# Altium schematic sheet FPGA.SCHDOC
size B
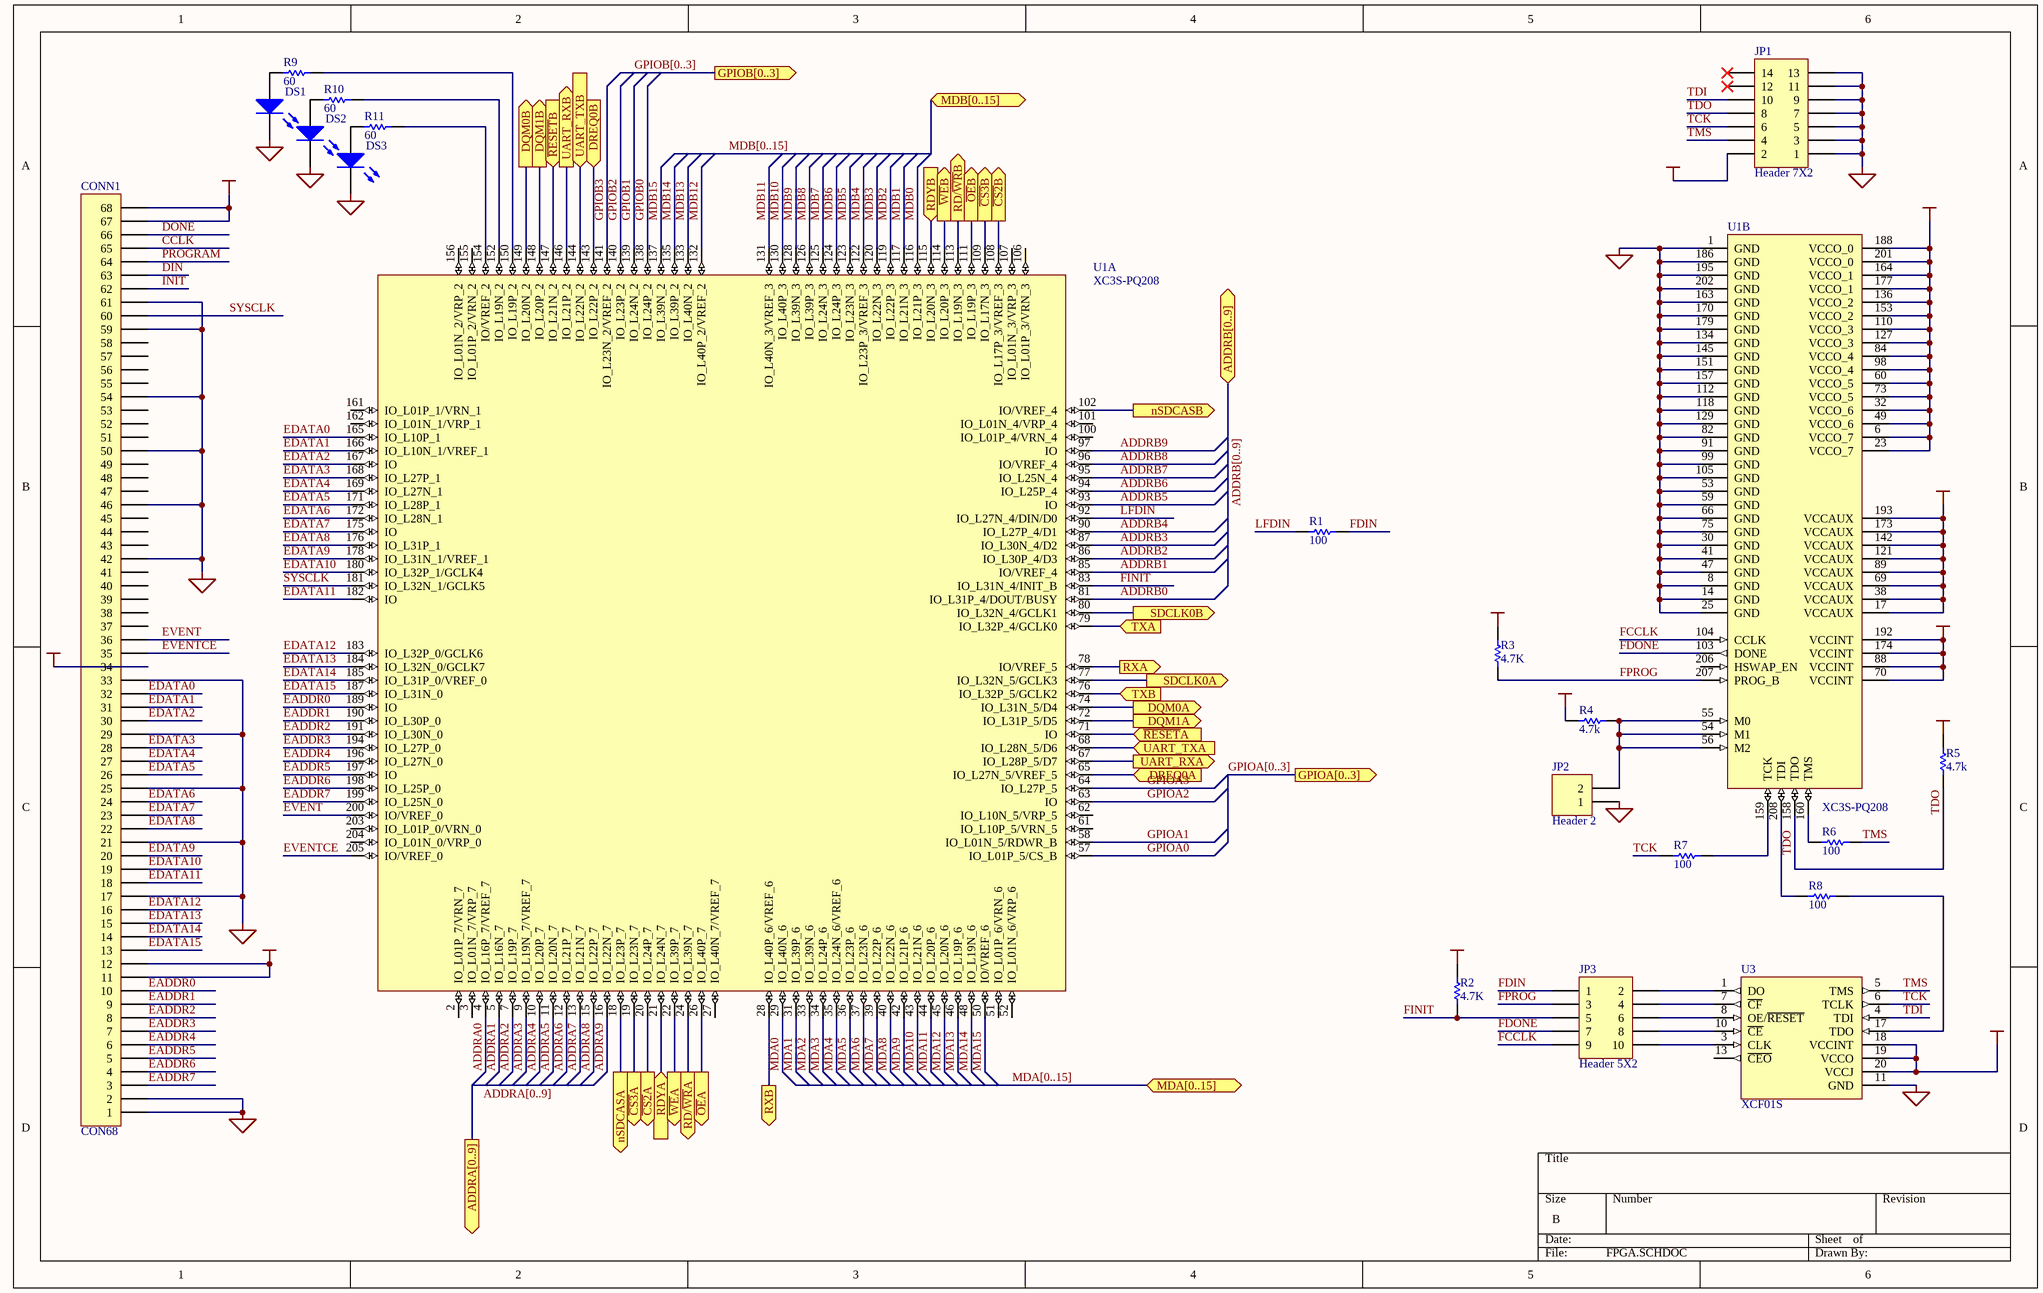
[diagram p0: FPGA.SCHDOC]

## Parts
CONN1  CON68  [MOLEX 15922068]
DS1  LED0  [T-1_LED]  (value not drawn)
DS2  LED0  [T-1_LED]  (value not drawn)
DS3  LED0  [T-1_LED]  (value not drawn)
JP1  Header 7X2  [HDR2x7-2mm]
JP2  Header 2  [HDR1X2]
JP3  Header 5X2  [HDR2X5]
R1  value 100  [CC1608-0603]  (hidden comment: Res1)
R2  value 4.7K  [CC1608-0603]  (hidden comment: Res1)
R3  value 4.7K  [CC1608-0603]  (hidden comment: Res1)
R4  value 4.7k  [CC1608-0603]  (hidden comment: Res1)
R5  value 4.7k  [CC1608-0603]  (hidden comment: Res1)
R6  value 100  [CC1608-0603]  (hidden comment: Res1)
R7  value 100  [CC1608-0603]  (hidden comment: Res1)
R8  value 100  [CC1608-0603]  (hidden comment: Res1)
R9  value 60  [CC1608-0603]  (hidden comment: Res1)
R10  value 60  [CC1608-0603]  (hidden comment: Res1)
R11  value 60  [CC1608-0603]  (hidden comment: Res1)
U1  XC3S-PQ208  [F-QFP28X28-G208/Z32N]  (parts A,B of 2)
U3  XCF01S  [TSSO6x6-G20/X.3]

## Ports
ADDRA[0..9], ADDRB[0..9] (bidir), DQM0A (out), DQM0B (out), DQM1A (out), DQM1B (out), DREQ0A (in), DREQ0B (in), GPIOA[0..3] (out), GPIOB[0..3] (out), MDA[0..15] (bidir), MDB[0..15] (bidir), nSDCASA (out), nSDCASB (out), RD/~{WR}A (out), RD/~{WR}B (out), RDYA (in), RDYB (in), RXA (out), RXB (out), SDCLK0A (out), SDCLK0B (out), TXA (in), TXB (in), UART_RXA (out), UART_RXB (out), UART_TXA (in), UART_TXB (in), ~{CS2}A (out), ~{CS2}B (out), ~{CS3}A (out), ~{CS3}B (out), ~{OE}A (out), ~{OE}B (out), ~{RESET}A (in), ~{RESET}B (in), ~{WE}A (out), ~{WE}B (out)

## Nets
+1.2VCC: U1.70(VCCINT) U1.88(VCCINT) U1.174(VCCINT) U1.192(VCCINT)
+2.5VCC: U1.17(VCCAUX) U1.38(VCCAUX) U1.69(VCCAUX) U1.89(VCCAUX) U1.121(VCCAUX) U1.142(VCCAUX) U1.173(VCCAUX) U1.193(VCCAUX)
+5VCC: CONN1.34
GND: CONN1.1 CONN1.2 CONN1.17 CONN1.21 CONN1.25 CONN1.29 CONN1.33 CONN1.42 CONN1.46 CONN1.50 CONN1.54 CONN1.59 CONN1.61 DS1.2(K) DS2.2(K) DS3.2(K) JP1.1 JP1.3 JP1.5 JP1.7 JP1.9 JP1.11 JP1.13 JP2.1 U1.1(GND) U1.8(GND) U1.14(GND) U1.25(GND) U1.30(GND) U1.41(GND) U1.47(GND) U1.53(GND) U1.59(GND) U1.66(GND) U1.75(GND) U1.82(GND) U1.91(GND) U1.99(GND) U1.105(GND) U1.112(GND) U1.118(GND) U1.129(GND) U1.134(GND) U1.145(GND) U1.151(GND) U1.157(GND) U1.163(GND) U1.170(GND) U1.179(GND) U1.186(GND) U1.195(GND) U1.202(GND) U3.11(GND)
VCC: CONN1.11 CONN1.12 CONN1.67 CONN1.68 JP1.2 R2.2 R3.2 R4.1 R5.2 U1.6(VCCO_7) U1.23(VCCO_7) U1.32(VCCO_6) U1.49(VCCO_6) U1.60(VCCO_5) U1.73(VCCO_5) U1.84(VCCO_4) U1.98(VCCO_4) U1.110(VCCO_3) U1.127(VCCO_3) U1.136(VCCO_2) U1.153(VCCO_2) U1.164(VCCO_1) U1.177(VCCO_1) U1.188(VCCO_0) U1.201(VCCO_0) U3.18(VCCINT) U3.19(VCCO) U3.20(VCCJ)
ADDRA0: U1.4(IO_L16P_7/VREF_7)
ADDRA1: U1.5(IO_L16N_7)
ADDRA2: U1.7(IO_L19P_7)
ADDRA3: U1.9(IO_L19N_7/VREF_7)
ADDRA4: U1.10(IO_L20P_7)
ADDRA5: U1.11(IO_L20N_7)
ADDRA6: U1.12(IO_L21P_7)
ADDRA7: U1.13(IO_L21N_7)
ADDRA8: U1.15(IO_L22P_7)
ADDRA9: U1.16(IO_L22N_7)
ADDRB0: U1.81(IO_L31P_4/DOUT/BUSY)
ADDRB1: U1.85(IO/VREF_4)
ADDRB2: U1.86(IO_L30P_4/D3)
ADDRB3: U1.87(IO_L30N_4/D2)
ADDRB4: U1.90(IO_L27P_4/D1)
ADDRB5: U1.93(IO)
ADDRB6: U1.94(IO_L25P_4)
ADDRB7: U1.95(IO_L25N_4)
ADDRB8: U1.96(IO/VREF_4)
ADDRB9: U1.97(IO)
~{CS2}A: U1.20(IO_L24P_7) ; port ~{CS2}A
~{CS2}B: U1.108(IO_L17P_3/VREF_3) ; port ~{CS2}B
~{CS3}A: U1.19(IO_L23N_7) ; port ~{CS3}A
~{CS3}B: U1.109(IO_L17N_3) ; port ~{CS3}B
CCLK: CONN1.65
DIN: CONN1.63
DONE: CONN1.66
DQM0A: U1.74(IO_L31N_5/D4) ; port DQM0A
DQM0B: U1.149(IO_L20N_2) ; port DQM0B
DQM1A: U1.72(IO_L31P_5/D5) ; port DQM1A
DQM1B: U1.148(IO_L20P_2) ; port DQM1B
DREQ0A: U1.65(IO_L27N_5/VREF_5) ; port DREQ0A
DREQ0B: U1.143(IO_L22P_2) ; port DREQ0B
EADDR0: CONN1.10 U1.189(IO)
EADDR1: CONN1.9 U1.190(IO_L30P_0)
EADDR2: CONN1.8 U1.191(IO_L30N_0)
EADDR3: CONN1.7 U1.194(IO_L27P_0)
EADDR4: CONN1.6 U1.196(IO_L27N_0)
EADDR5: CONN1.5 U1.197(IO)
EADDR6: CONN1.4 U1.198(IO_L25P_0)
EADDR7: CONN1.3 U1.199(IO_L25N_0)
EDATA0: CONN1.32 U1.165(IO_L10P_1)
EDATA1: CONN1.31 U1.166(IO_L10N_1/VREF_1)
EDATA2: CONN1.30 U1.167(IO)
EDATA3: CONN1.28 U1.168(IO_L27P_1)
EDATA4: CONN1.27 U1.169(IO_L27N_1)
EDATA5: CONN1.26 U1.171(IO_L28P_1)
EDATA6: CONN1.24 U1.172(IO_L28N_1)
EDATA7: CONN1.23 U1.175(IO)
EDATA8: CONN1.22 U1.176(IO_L31P_1)
EDATA9: CONN1.20 U1.178(IO_L31N_1/VREF_1)
EDATA10: CONN1.19 U1.180(IO_L32P_1/GCLK4)
EDATA11: CONN1.18 U1.182(IO)
EDATA12: CONN1.16 U1.183(IO_L32P_0/GCLK6)
EDATA13: CONN1.15 U1.184(IO_L32N_0/GCLK7)
EDATA14: CONN1.14 U1.185(IO_L31P_0/VREF_0)
EDATA15: CONN1.13 U1.187(IO_L31N_0)
EVENT: CONN1.36 U1.200(IO/VREF_0)
EVENTCE: CONN1.35 U1.205(IO/VREF_0)
FCCLK: JP3.9 U1.104(CCLK)
FDIN: JP3.1 R1.2
FDONE: JP3.7 U1.103(DONE)
FINIT: JP3.5 R2.1 U1.83(IO_L31N_4/INIT_B)
FPROG: JP3.3 R3.1 U1.207(PROG_B)
GPIOA0: U1.57(IO_L01P_5/CS_B)
GPIOA1: U1.58(IO_L01N_5/RDWR_B)
GPIOA2: U1.63(IO)
GPIOA3: U1.64(IO_L27P_5)
GPIOB0: U1.138(IO_L24P_2)
GPIOB1: U1.139(IO_L24N_2)
GPIOB2: U1.140(IO_L23P_2)
GPIOB3: U1.141(IO_L23N_2/VREF_2)
INIT: CONN1.62
LFDIN: R1.1 U1.92(IO_L27N_4/DIN/D0)
MDA0: U1.29(IO_L40N_6)
MDA1: U1.31(IO_L39P_6)
MDA2: U1.33(IO_L39N_6)
MDA3: U1.34(IO_L24P_6)
MDA4: U1.35(IO_L24N_6/VREF_6)
MDA5: U1.36(IO_L23P_6)
MDA6: U1.37(IO_L23N_6)
MDA7: U1.39(IO_L22P_6)
MDA8: U1.40(IO_L22N_6)
MDA9: U1.42(IO_L21P_6)
MDA10: U1.43(IO_L21N_6)
MDA11: U1.44(IO_L20P_6)
MDA12: U1.45(IO_L20N_6)
MDA13: U1.46(IO_L19P_6)
MDA14: U1.48(IO_L19N_6)
MDA15: U1.50(IO/VREF_6)
MDB0: U1.116(IO_L21P_3)
MDB1: U1.117(IO_L21N_3)
MDB2: U1.119(IO_L22P_3)
MDB3: U1.120(IO_L22N_3)
MDB4: U1.122(IO_L23P_3/VREF_3)
MDB5: U1.123(IO_L23N_3)
MDB6: U1.124(IO_L24P_3)
MDB7: U1.125(IO_L24N_3)
MDB8: U1.126(IO_L39P_3)
MDB9: U1.128(IO_L39N_3)
MDB10: U1.130(IO_L40P_3)
MDB11: U1.131(IO_L40N_3/VREF_3)
MDB12: U1.132(IO_L40P_2/VREF_2)
MDB13: U1.133(IO_L40N_2)
MDB14: U1.135(IO_L39P_2)
MDB15: U1.137(IO_L39N_2)
nSDCASA: U1.18(IO_L23P_7) ; port nSDCASA
nSDCASB: U1.102(IO/VREF_4) ; port nSDCASB
~{OE}A: U1.26(IO_L40P_7) ; port ~{OE}A
~{OE}B: U1.111(IO_L19P_3) ; port ~{OE}B
~{PROGRAM}: CONN1.64
~{RESET}A: U1.71(IO) ; port ~{RESET}A
~{RESET}B: U1.147(IO_L21N_2) ; port ~{RESET}B
RD/~{WR}A: U1.24(IO_L39N_7) ; port RD/~{WR}A
RD/~{WR}B: U1.113(IO_L19N_3) ; port RD/~{WR}B
RDYA: U1.21(IO_L24N_7) ; port RDYA
RDYB: U1.115(IO_L20N_3) ; port RDYB
RXA: U1.78(IO/VREF_5) ; port RXA
RXB: U1.28(IO_L40P_6/VREF_6) ; port RXB
SDCLK0A: U1.77(IO_L32N_5/GCLK3) ; port SDCLK0A
SDCLK0B: U1.80(IO_L32N_4/GCLK1) ; port SDCLK0B
SYSCLK: CONN1.60 U1.181(IO_L32N_1/GCLK5)
TCK: JP1.6 R7.2 U3.6(TCLK)
TDI: JP1.10 U3.4(TDI)
TDO: JP1.8 R5.1 U1.158(TDO)
TMS: JP1.4 R6.1 U3.5(TMS)
TXA: U1.79(IO_L32P_4/GCLK0) ; port TXA
TXB: U1.76(IO_L32P_5/GCLK2) ; port TXB
UART_RXA: U1.67(IO_L28P_5/D7) ; port UART_RXA
UART_RXB: U1.146(IO_L21P_2) ; port UART_RXB
UART_TXA: U1.68(IO_L28N_5/D6) ; port UART_TXA
UART_TXB: U1.144(IO_L22N_2) ; port UART_TXB
~{WE}A: U1.22(IO_L39P_7) ; port ~{WE}A
~{WE}B: U1.114(IO_L20P_3) ; port ~{WE}B
NetDS1_1: DS1.1(A) R9.1
NetDS2_1: DS2.1(A) R10.1
NetDS3_1: DS3.1(A) R11.1
NetJP2_2: JP2.2 R4.2 U1.54(M1) U1.55(M0) U1.56(M2)
NetJP3_2: JP3.2 U3.1(DO)
NetJP3_4: JP3.4 U3.7(~{CF})
NetJP3_6: JP3.6 U3.8(OE/~{RESET})
NetJP3_8: JP3.8 U3.10(~{CE})
NetJP3_10: JP3.10 U3.3(CLK)
NetR6_2: R6.2 U1.160(TMS)
NetR7_1: R7.1 U1.159(TCK)
NetR8_1: R8.1 U3.17(TDO)
NetR8_2: R8.2 U1.208(TDI)
NetR9_2: R9.2 U1.150(IO_L19P_2)
NetR10_2: R10.2 U1.152(IO_L19N_2)
NetR11_2: R11.2 U1.154(IO/VREF_2)

Not connected (* = marked no-connect by the designer): CONN1 37 38 39 40 41 43 44 45 47 48 49 51 52 53 55 56 57 58; JP1 12* 14*; U1 2(IO_L01P_7/VRN_7) 3(IO_L01N_7/VRP_7) 27(IO_L40N_7/VREF_7) 51(IO_L01P_6/VRN_6) 52(IO_L01N_6/VRP_6) 61(IO_L10P_5/VRN_5) 62(IO_L10N_5/VRP_5) 100(IO_L01P_4/VRN_4) 101(IO_L01N_4/VRP_4) 106(IO_L01P_3/VRN_3) 107(IO_L01N_3/VRP_3) 155(IO_L01P_2/VRN_2) 156(IO_L01N_2/VRP_2) 161(IO_L01P_1/VRN_1) 162(IO_L01N_1/VRP_1) 203(IO_L01P_0/VRN_0) 204(IO_L01N_0/VRP_0) 206(HSWAP_EN); U3 13(~{CEO})

## Buses and harness runs
bus ADDRA[0..9] = port ADDRA[0..9]
bus ADDRB[0..9] = port ADDRB[0..9]
bus GPIOA[0..3] = port GPIOA[0..3]
bus GPIOB[0..3] = port GPIOB[0..3]
bus MDA[0..15] = port MDA[0..15]
bus MDB[0..15] = port MDB[0..15]

## Library data of the parts
DS1-DS3 = LED0: Typical INFRARED GaAs LED; Manufacturer: Generic Components; Class I: Optoelectronic; Published: 8-Jun-2000; Revision: July-2002: Re-released for DXP Platform.; Publisher: Altium Limited; Class II: LED
JP1 = Header 7X2: Header, 7-Pin, Dual row; Manufacturer: Generic Components; Class I: Connector; Revision: July-2002: Re-released for DXP Platform.; Publisher: Altium Limited
JP2 = Header 2: Header, 2-Pin; Manufacturer: Generic Components; Class I: Connector; Revision: July-2002: Re-released for DXP Platform.; Publisher: Altium Limited
JP3 = Header 5X2: Header, 5-Pin, Dual row; Manufacturer: Generic Components; Class I: Connector; Revision: July-2002: Re-released for DXP Platform.; Publisher: Altium Limited
R1-R11 = Res1: Resistor; Manufacturer: Generic Components; Class I: Passive; Published: 8-Jun-2000; Revision: July-2002: Re-released for DXP Platform.; Publisher: Altium Limited; Class II: Resistor
U1 = XC3S-PQ208: Xilinx Spartan-3 PQ208
U3 = XCF01S: Xilinx Platform Flash